# Altium project dtb-222.PrjPcb
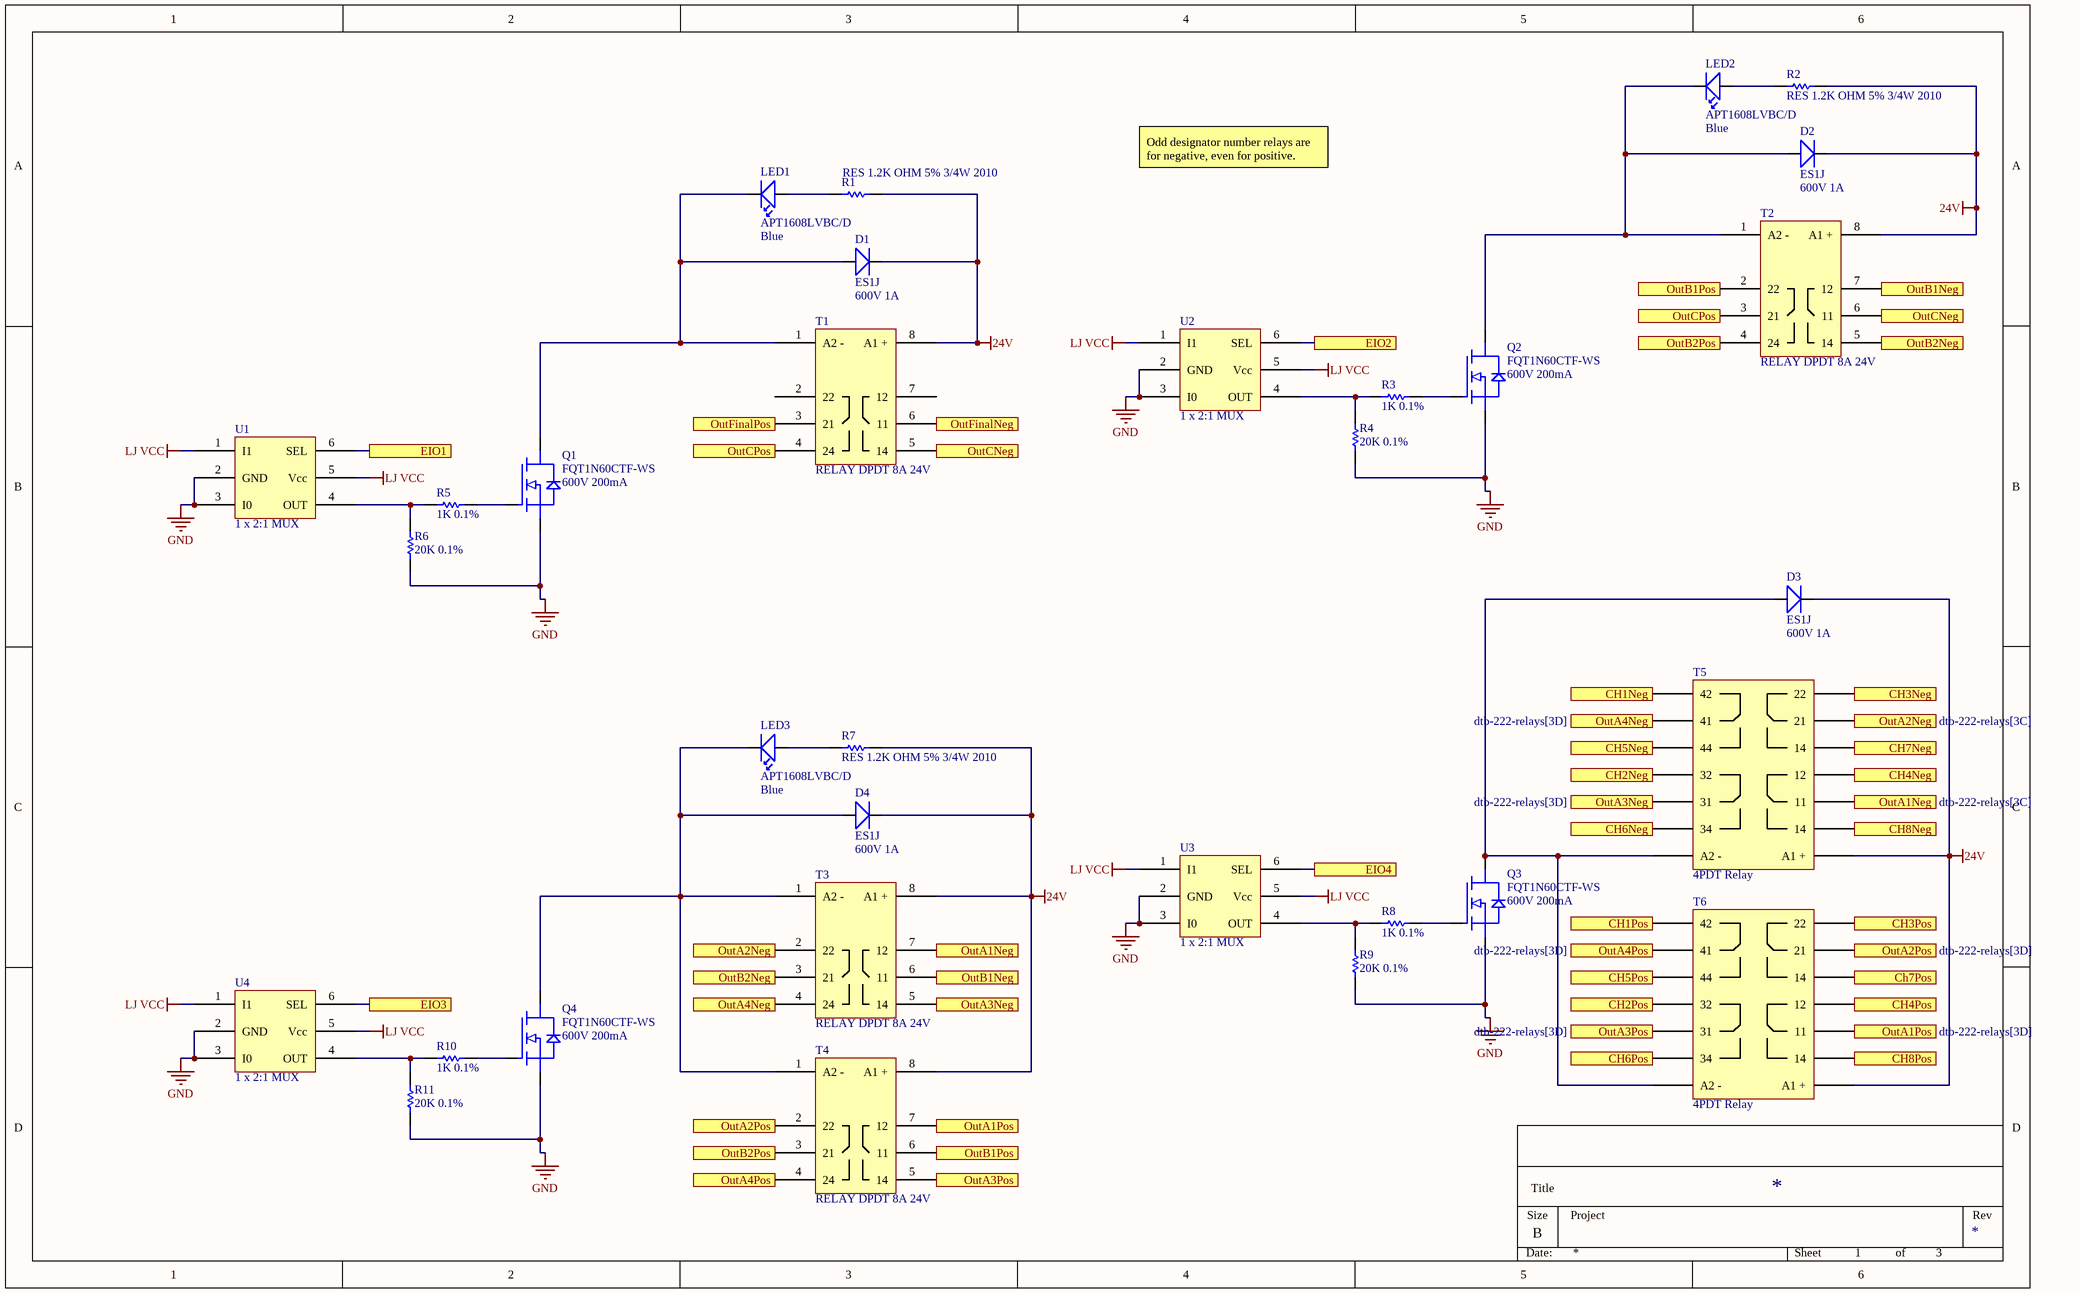
[diagram p0: dtb-222-relays.SchDoc]
3 sheets, 54 parts. Net scope: flat (ports and power ports of the same name join across sheets).
Board file: dtb-222-AW1.PcbDoc
Sheets:
  dtb-222-relays.SchDoc
  dtb-222-connectors.SchDoc
  dtb-222-24V-supply.SchDoc

## Sheet dtb-222-relays.SchDoc
size 381 x 241 mm; SheetNumber: 1; SheetTotal: 3

### Parts
(Parts that share a designator on the sheet are numbered #1, #2 ... from top to bottom, then left to right.)
?#1  (no value)  (graphical)
D1  ES1J  value 600V 1A  [ES1J]
D2  ES1J  value 600V 1A  [ES1J]
D3  ES1J  value 600V 1A  [ES1J]
D4  ES1J  value 600V 1A  [ES1J]
LED1  APT1608LVBC/D  value Blue  [Standard VoltServer 0603 Kingbright HELI2 LED Footprint]
LED2  APT1608LVBC/D  value Blue  [Standard VoltServer 0603 Kingbright HELI2 LED Footprint]
LED3  APT1608LVBC/D  value Blue  [Standard VoltServer 0603 Kingbright HELI2 LED Footprint]
Q1  FQT1N60CTF-WS  value 600V 200mA  [FQT1N60CTF_WS]
Q2  FQT1N60CTF-WS  value 600V 200mA  [FQT1N60CTF_WS]
Q3  FQT1N60CTF-WS  value 600V 200mA  [FQT1N60CTF_WS]
Q4  FQT1N60CTF-WS  value 600V 200mA  [FQT1N60CTF_WS]
R1  RES 1.2K OHM 5% 3/4W 2010  [2010 Resistor]
R2  RES 1.2K OHM 5% 3/4W 2010  [2010 Resistor]
R3  value 1K 0.1%  [Standard VoltServer 0603 Resistor Footprint]  (hidden comment: ERA-3AEB102V)
R4  value 20K 0.1%  [Standard VoltServer 0603 Resistor Footprint]  (hidden comment: ERA-3AEB203V)
R5  value 1K 0.1%  [Standard VoltServer 0603 Resistor Footprint]  (hidden comment: ERA-3AEB102V)
R6  value 20K 0.1%  [Standard VoltServer 0603 Resistor Footprint]  (hidden comment: ERA-3AEB203V)
R7  RES 1.2K OHM 5% 3/4W 2010  [2010 Resistor]
R8  value 1K 0.1%  [Standard VoltServer 0603 Resistor Footprint]  (hidden comment: ERA-3AEB102V)
R9  value 20K 0.1%  [Standard VoltServer 0603 Resistor Footprint]  (hidden comment: ERA-3AEB203V)
R10  value 1K 0.1%  [Standard VoltServer 0603 Resistor Footprint]  (hidden comment: ERA-3AEB102V)
R11  value 20K 0.1%  [Standard VoltServer 0603 Resistor Footprint]  (hidden comment: ERA-3AEB203V)
T1  RELAY DPDT 8A 24V  [2961435]
T2  RELAY DPDT 8A 24V  [2961435]
T3  RELAY DPDT 8A 24V  [2961435]
T4  RELAY DPDT 8A 24V  [2961435]
T5  4PDT Relay  [2903677]
T6  4PDT Relay  [2903677]
U1  1 x 2:1 MUX  [74LVC1G157GV,125]
U2  1 x 2:1 MUX  [74LVC1G157GV,125]
U3  1 x 2:1 MUX  [74LVC1G157GV,125]
U4  1 x 2:1 MUX  [74LVC1G157GV,125]

### Ports
CH1Neg (see dtb-222-connectors[3A]), CH1Pos (see dtb-222-connectors[3A]), CH2Neg (see dtb-222-connectors[3A]), CH2Pos (see dtb-222-connectors[3A]), CH3Neg (see dtb-222-connectors[3A]), CH3Pos (see dtb-222-connectors[3A]), CH4Neg (see dtb-222-connectors[3A]), CH4Pos (see dtb-222-connectors[3A]), CH5Neg (see dtb-222-connectors[3A]), CH5Pos (see dtb-222-connectors[3A]), CH6Neg (see dtb-222-connectors[3B]), CH6Pos (see dtb-222-connectors[3A]), CH7Neg (see dtb-222-connectors[3A]), Ch7Pos (see dtb-222-connectors[3B]), CH8Neg (see dtb-222-connectors[3A]), CH8Pos (see dtb-222-connectors[3A]), EIO1 (see dtb-222-connectors[2A]), EIO2 (see dtb-222-connectors[1A]), EIO3 (see dtb-222-connectors[2A]), EIO4 (see dtb-222-connectors[1A]), OutA1Neg (see dtb-222-relays[3C]), OutA1Neg (see dtb-222-relays[6C]), OutA1Pos (see dtb-222-relays[3D]), OutA1Pos (see dtb-222-relays[6D]), OutA2Neg (see dtb-222-relays[3C]), OutA2Neg (see dtb-222-relays[6C]), OutA2Pos (see dtb-222-relays[3D]), OutA2Pos (see dtb-222-relays[6C]), OutA3Neg (see dtb-222-relays[3D]), OutA3Neg (see dtb-222-relays[5C]), OutA3Pos (see dtb-222-relays[3D]), OutA3Pos (see dtb-222-relays[5D]), OutA4Neg (see dtb-222-relays[3D]), OutA4Neg (see dtb-222-relays[5C]), OutA4Pos (see dtb-222-relays[3D]), OutA4Pos (see dtb-222-relays[5C]), OutB1Neg (see dtb-222-relays[3D]), OutB1Neg (see dtb-222-relays[6A]), OutB1Pos (see dtb-222-relays[3D]), OutB1Pos (see dtb-222-relays[5A]), OutB2Neg (see dtb-222-relays[3D]), OutB2Neg (see dtb-222-relays[6B]), OutB2Pos (see dtb-222-relays[3D]), OutB2Pos (see dtb-222-relays[5B]), OutCNeg (see dtb-222-relays[3B]), OutCNeg (see dtb-222-relays[6A]), OutCPos (see dtb-222-relays[3B]), OutCPos (see dtb-222-relays[5A]), OutFinalNeg (see dtb-222-connectors[3B]), OutFinalPos (see dtb-222-connectors[3B])

### Nets
24V: D1.1 D2.1 D3.1 D4.1 R1.2 R2.2 R7.2 T1.8(A1_+) T2.8(A1_+) T3.8(A1_+) T4.8(A1_+) T5.1(A1_+) T6.1(A1_+)
GND: Q1.3(S) Q2.3(S) Q3.3(S) Q4.3(S) R4.1 R6.1 R9.1 R11.1 U1.2(GND) U1.3(I0) U2.2(GND) U2.3(I0) U3.2(GND) U3.3(I0) U4.2(GND) U4.3(I0)
LJ VCC: U1.1(I1) U1.5(Vcc) U2.1(I1) U2.5(Vcc) U3.1(I1) U3.5(Vcc) U4.1(I1) U4.5(Vcc)
NetD1_2: D1.2 LED1.2 Q1.4(D) T1.1(A2_-)
NetD2_2: D2.2 LED2.2 Q2.4(D) T2.1(A2_-)
NetD3_2: D3.2 Q3.4(D) T5.2(A2_-) T6.2(A2_-)
NetD4_2: D4.2 LED3.2 Q4.4(D) T3.1(A2_-) T4.1(A2_-)
NetJ1_5: U2.6(SEL) ; port EIO2
NetJ1_6: U3.6(SEL) ; port EIO4
NetJ1_12: U1.6(SEL) ; port EIO1
NetJ1_13: U4.6(SEL) ; port EIO3
NetJ3_1: T5.11(12) ; port CH4Neg
NetJ3_2: T6.11(12) ; port CH4Pos
NetJ3_3: T5.12(22) ; port CH3Neg
NetJ3_4: T6.12(22) ; port CH3Pos
NetJ3_5: T5.13(32) ; port CH2Neg
NetJ3_6: T6.13(32) ; port CH2Pos
NetJ3_7: T5.14(42) ; port CH1Neg
NetJ3_8: T6.14(42) ; port CH1Pos
NetJ4_1: T5.7(14) ; port CH8Neg
NetJ4_2: T6.7(14) ; port CH8Pos
NetJ4_3: T5.8(14) ; port CH7Neg
NetJ4_4: T6.8(14) ; port Ch7Pos
NetJ4_5: T5.9(34) ; port CH6Neg
NetJ4_6: T6.9(34) ; port CH6Pos
NetJ4_7: T5.10(44) ; port CH5Neg
NetJ4_8: T6.10(44) ; port CH5Pos
NetJ5_1: T1.3(21) ; port OutFinalPos
NetJ5_2: T1.6(11) ; port OutFinalNeg
NetLED1_1: LED1.1 R1.1
NetLED2_1: LED2.1 R2.1
NetLED3_1: LED3.1 R7.1
NetQ1_1: Q1.1(G) R5.1
NetQ2_1: Q2.1(G) R3.1
NetQ3_1: Q3.1(G) R8.1
NetQ4_1: Q4.1(G) R10.1
NetR3_2: R3.2 R4.2 U2.4(OUT)
NetR5_2: R5.2 R6.2 U1.4(OUT)
NetR8_2: R8.2 R9.2 U3.4(OUT)
NetR10_2: R10.2 R11.2 U4.4(OUT)
NetT1_4: T1.4(24) T2.3(21) ; port OutCPos
NetT1_5: T1.5(14) T2.6(11) ; port OutCNeg
NetT2_2: T2.2(22) T4.6(11) ; port OutB1Pos
NetT2_4: T2.4(24) T4.3(21) ; port OutB2Pos
NetT2_5: T2.5(14) T3.3(21) ; port OutB2Neg
NetT2_7: T2.7(12) T3.6(11) ; port OutB1Neg
NetT3_2: T3.2(22) T5.4(21) ; port OutA2Neg
NetT3_4: T3.4(24) T5.6(41) ; port OutA4Neg
NetT3_5: T3.5(14) T5.5(31) ; port OutA3Neg
NetT3_7: T3.7(12) T5.3(11) ; port OutA1Neg
NetT4_2: T4.2(22) T6.4(21) ; port OutA2Pos
NetT4_4: T4.4(24) T6.6(41) ; port OutA4Pos
NetT4_5: T4.5(14) T6.5(31) ; port OutA3Pos
NetT4_7: T4.7(12) T6.3(11) ; port OutA1Pos

Not connected (* = marked no-connect by the designer): T1 2(22) 7(12)

### Notes on the sheet
- Odd designator number relays are for negative, even for positive.
- Size
- Title
- B
- Project
- Rev
- Date:
- Sheet
- of

### Library data of the parts
?#1 = VoltServer Title Block
D1-D4 = ES1J: DIODE 1A 600V 35nS SMA; Manufacturer: Fairchild; Vendor PN: ES1JFSCT-ND; Vendor: Digikey; Manufacturer PN: ES1J
LED1-LED3 = APT1608LVBC/D: Blue 470nm LED Indication - Discrete 2.65V 0603 (1608 Metric); Manufacturer: Kingbright; Vendor: Digikey; Vendor PN: 754-1933-1-ND; Manufacturer PN: APT1608LVBC/D
Q1-Q4 = FQT1N60CTF-WS: MOSFET N-CH 600V 200MA SOT-223-4; Manufacturer: Fairchild Semiconductor; Vendor: Digikey; Vendor PN: FQT1N60CTF-WSCT-ND; Manufacturer PN: FQT1N60CTF-WS
R1 R2 R7 = RMCF2010JT1K20: 1.2 kOhms ±5% 0.75W, 3/4W Chip Resistor 2010 (5025 Metric) Automotive AEC-Q200 Thick Film; Manufacturer: Stackpole Electionics Inc; Value: 1.2 kOhm, +/- 5%, 0.75W; Vendor: Digi-Key; Vendor PN: RMCF2010JT1K20CT-ND; Manufacturer PN: RMCF2010JT1K20
R3 R5 R8 R10 = ERA-3AEB102V: RES SMD 1K OHM 0.1% 1/10W 0603; Manufacturer: Panasonic; Vendor: Digikey; Vendor PN: P1.0KDBCT-ND; Manufacturer PN: ERA-3AEB102V
R4 R6 R9 R11 = ERA-3AEB203V: RES SMD 20K OHM 0.1% 1/10W 0603; Manufacturer: Panasonic; Vendor: Digikey; Vendor PN: P20KDBCT-ND; Manufacturer PN: ERA-3AEB203V
T1-T4 = 2961435 with R95-132: Relay 2961435 with R95-132 socket for pcb mounting; Manufacturer: Phoenix Contact; NTE Electronics Inc; Manufacturer PN: 2961435; R95-132; Vendor: Digi-Key; Vendor PN: 277-5185-ND; 2368-R95-132-ND; Value: DPDT Relay
T5 T6 = 2903677 with PY14-02: General Purpose Relay 4PDT (4 Form C) 24VDC Coil Socketable with Socket; Manufacturer: Phoenix Contact; Omron Automation and Safety; Manufacturer PN: 2903677; PY14-02; Vendor: Digi-Key; Vendor PN: 277-11902-ND; Z813-ND; Value: 4PDT Relay with Socket
U1-U4 = 74LVC1G157GV,125: Multiplexer 1 x 2:1 6-TSOP; Manufacturer: Nexperia USA Inc.; Vendor: Digi-Key; Vendor PN: 1727-3490-1-ND; Value: 1 x 2:1 MUX; Manufacturer PN: 74LVC1G157GV,125

## Sheet dtb-222-connectors.SchDoc
size 381 x 241 mm; SheetNumber: 2; SheetTotal: 3
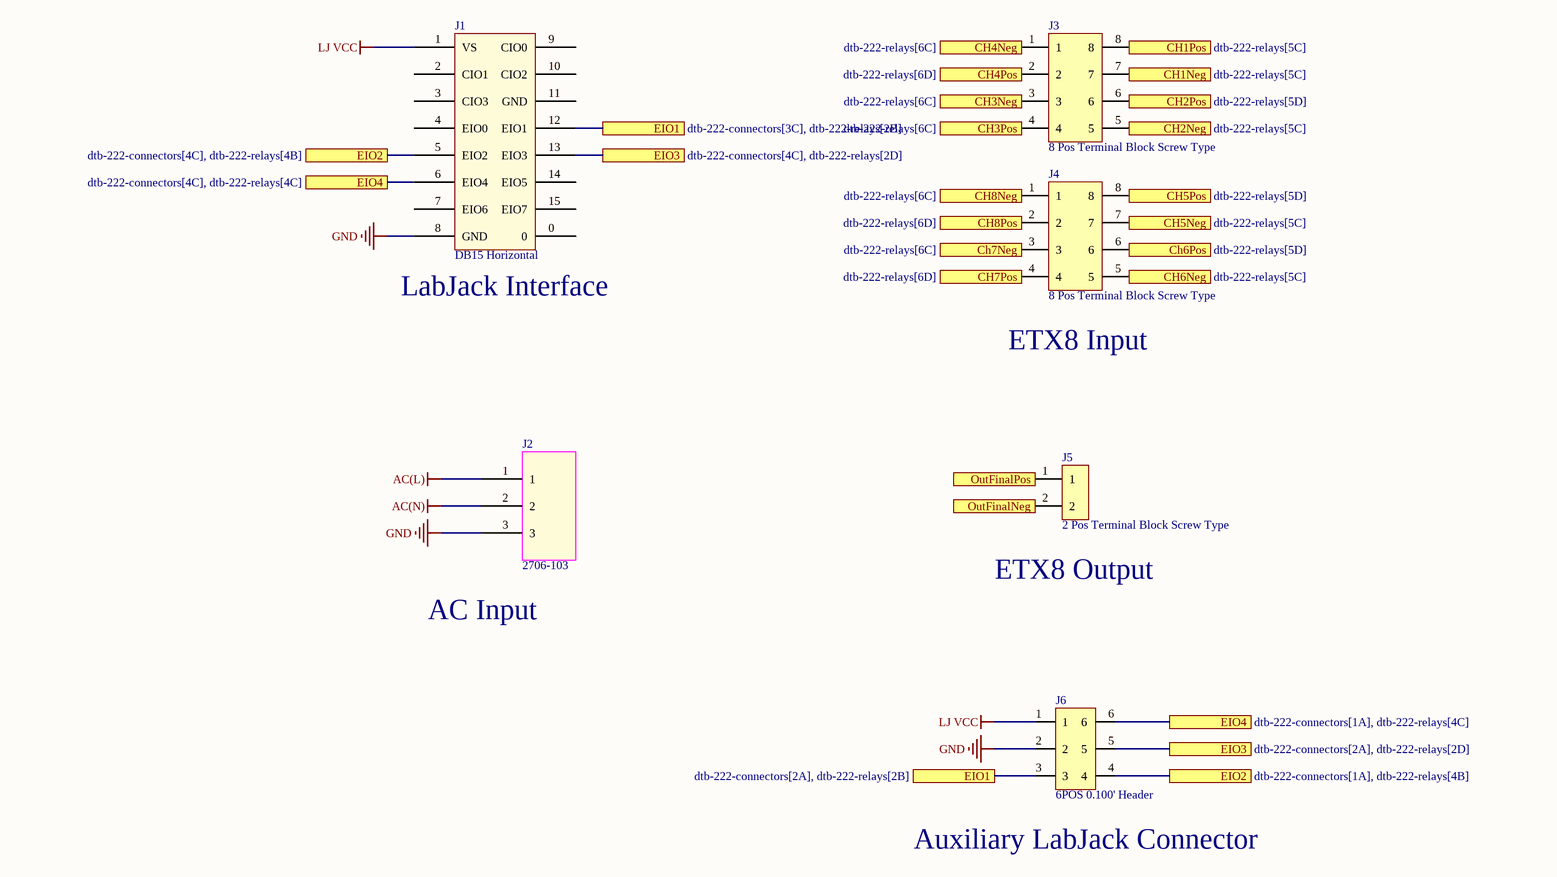
[diagram p1: dtb-222-connectors.SchDoc]

### Parts
(Parts that share a designator on the sheet are numbered #1, #2 ... from top to bottom, then left to right.)
?#2  (no value)  (graphical)
J1  DB15 Horizontal  [182-015-113R531]
J2  2706-103  [2706-103]
J3  8 Pos Terminal Block Screw Type  [TB008A-508-08BE]
J4  8 Pos Terminal Block Screw Type  [TB008A-508-08BE]
J5  2 Pos Terminal Block Screw Type  [TB008A-508-02BE]
J6  6POS 0.100' Header  [67997-206HLF]

### Ports
CH1Neg (see dtb-222-relays[5C]), CH1Pos (see dtb-222-relays[5C]), CH2Neg (see dtb-222-relays[5C]), CH2Pos (see dtb-222-relays[5D]), CH3Neg (see dtb-222-relays[6C]), CH3Pos (see dtb-222-relays[6C]), CH4Neg (see dtb-222-relays[6C]), CH4Pos (see dtb-222-relays[6D]), CH5Neg (see dtb-222-relays[5C]), CH5Pos (see dtb-222-relays[5D]), CH6Neg (see dtb-222-relays[5C]), Ch6Pos (see dtb-222-relays[5D]), Ch7Neg (see dtb-222-relays[6C]), CH7Pos (see dtb-222-relays[6D]), CH8Neg (see dtb-222-relays[6C]), CH8Pos (see dtb-222-relays[6D]), EIO1 (see dtb-222-connectors[2A], dtb-222-relays[2B]), EIO1 (see dtb-222-connectors[3C], dtb-222-relays[2B]), EIO2 (see dtb-222-connectors[1A], dtb-222-relays[4B]), EIO2 (see dtb-222-connectors[4C], dtb-222-relays[4B]), EIO3 (see dtb-222-connectors[2A], dtb-222-relays[2D]), EIO3 (see dtb-222-connectors[4C], dtb-222-relays[2D]), EIO4 (see dtb-222-connectors[1A], dtb-222-relays[4C]), EIO4 (see dtb-222-connectors[4C], dtb-222-relays[4C]), OutFinalNeg (see dtb-222-relays[3B]), OutFinalPos (see dtb-222-relays[3B])

### Nets
AC(L): J2.1
AC(N): J2.2
GND: J1.8(GND) J2.3 J6.2
LJ VCC: J1.1(VS) J6.1
NetJ1_5: J1.5(EIO2) J6.4 ; port EIO2
NetJ1_6: J1.6(EIO4) J6.6 ; port EIO4
NetJ1_12: J1.12(EIO1) J6.3 ; port EIO1
NetJ1_13: J1.13(EIO3) J6.5 ; port EIO3
NetJ3_1: J3.1 ; port CH4Neg
NetJ3_2: J3.2 ; port CH4Pos
NetJ3_3: J3.3 ; port CH3Neg
NetJ3_4: J3.4 ; port CH3Pos
NetJ3_5: J3.5 ; port CH2Neg
NetJ3_6: J3.6 ; port CH2Pos
NetJ3_7: J3.7 ; port CH1Neg
NetJ3_8: J3.8 ; port CH1Pos
NetJ4_1: J4.1 ; port CH8Neg
NetJ4_2: J4.2 ; port CH8Pos
NetJ4_3: J4.3 ; port Ch7Neg
NetJ4_4: J4.4 ; port CH7Pos
NetJ4_5: J4.5 ; port CH6Neg
NetJ4_6: J4.6 ; port Ch6Pos
NetJ4_7: J4.7 ; port CH5Neg
NetJ4_8: J4.8 ; port CH5Pos
NetJ5_1: J5.1 ; port OutFinalPos
NetJ5_2: J5.2 ; port OutFinalNeg

Not connected (* = marked no-connect by the designer): J1 0 2(CIO1) 3(CIO3) 4(EIO0) 7(EIO6) 9(CIO0) 10(CIO2) 11(GND) 14(EIO5) 15(EIO7)

### Notes on the sheet
- (near J1) LabJack Interface
- (near J4) ETX8 Input
- AC Input
- (near J5) ETX8 Output
- (near J6) Auxiliary LabJack Connector
- Size
- Title
- B
- Project
- Rev
- Date:
- Sheet
- of

### Library data of the parts
?#2 = VoltServer Title Block
J1 = DB15 LabJack Pinout: 15 Position D-Sub Plug, Male Pins Connector; Manufacturer: NorComp Inc.; Vendor: Digikey; Vendor PN: 182-15ME-ND; Value: DB 16 Male; Manufacturer PN: 182-015-113R531
J2 = 2706-103: 3 Position Wire to Board Terminal Block Horizontal with Board 0.295" (7.50mm) Through Hole; Manufacturer: WAGO Corporation; Value: 3-Pos Terminal Block Horizontal; Vendor: Digi-Key; Vendor PN: 2946-2706-103-ND; Manufacturer PN: 2706-103
J3 J4 = TB008A-508-08BE: 8 Position Wire to Board Terminal Block 45° (135°) Angle with Board 0.200" (5.08mm) Through Hole; Manufacturer: CUI Devices; Manufacturer PN: TB008A-508-08DE; Vendor: Digi-Key; Vendor PN: 102-6216-ND; Value: 8 pos screw terminal
J5 = TB008A-508-02BE: 2 Position Wire to Board Terminal Block 45° (135°) Angle with Board 0.200" (5.08mm) Through Hole; Manufacturer: CUI Devices; Manufacturer PN: TB008A-508-02DE; Vendor: Digi-Key; Vendor PN: 102-6213-ND; Value: 2 pos screw terminal
J6 = 67997-206HLF: Connector Header Through Hole 6 position 0.100" (2.54mm); Manufacturer: Amphenol ICC (FCI); Vendor: Digi-Key; Vendor PN: 609-3234-ND; Value: CONN HEADER VERT 6POS 2.54MM; Manufacturer PN: 67997-206HLF

## Sheet dtb-222-24V-supply.SchDoc
size 381 x 241 mm; SheetNumber: 3; SheetTotal: 3
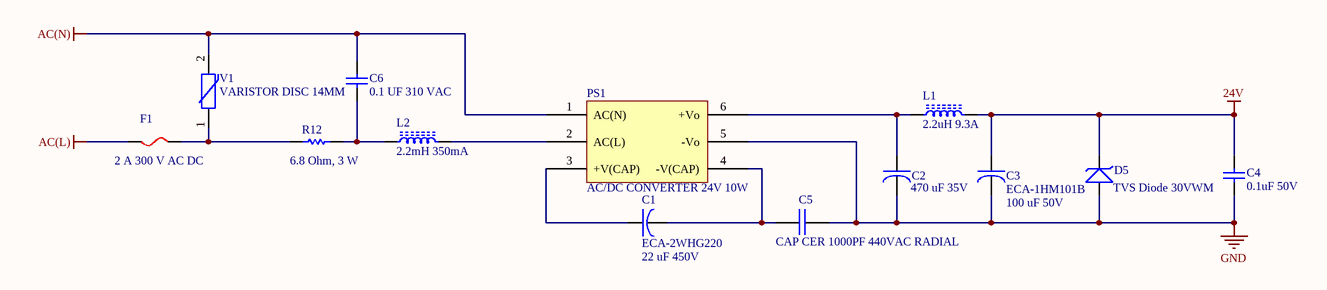
[diagram p2: dtb-222-24V-supply.SchDoc]

### Parts
(Parts that share a designator on the sheet are numbered #1, #2 ... from top to bottom, then left to right.)
?#3  (no value)  (graphical)
C1  ECA-2WHG220  value 22 uF 450V  [ECA-2WHG220]
C2  value 470 uF 35V  [35PX470MEFC10X12.5]  (hidden comment: 35PX470MEFC10X12.5)
C3  ECA-1HM101B  value 100 uF 50V  [ECA-1HM101B]
C4  value 0.1uF 50V  [Standard VoltServer 0603 Capacitor Footprint]  (hidden comment: CGA3E2X7R1H104K080AE)
C5  CAP CER 1000PF 440VAC RADIAL  [CD45-E2GA102M-VKA]
C6  value 0.1 UF 310 VAC  [890334023023CS]  (hidden comment: CAP FILM 0.1UF 10%)
D5  value TVS Diode 30VWM  [SMBJ30A]  (hidden comment: TVS DIODE 30VWM 48.4VC SMB)
F1  2 A 300 V AC DC  [SS-5H-2A-APH]
L1  value 2.2uH 9.3A  [0630CDMCCDS-2R2MC]  (hidden comment: FIXED IND 2.2UH 9.3A 15MOHM SMD)
L2  value 2.2mH 350mA  [RLB1112V4-222J]  (hidden comment: FIXED IND 2.2MH 350MA 3.2 OHM TH)
PS1  AC/DC CONVERTER 24V 10W  [LS10-13B24R3]
R12  value 6.8 Ohm, 3 W  [AC03000006808JAC00]  (hidden comment: RES 6.8 OHM 3W 5% AXIAL)
V1  VARISTOR DISC 14MM  [B72214S0351K101]

### Nets
24V: C3.1 C4.2 D5.1(Cathode) L1.2
AC(L): F1.1
AC(N): C6.2 PS1.1(AC(N)) V1.2
GND: C2.2 C3.2 C4.1 C5.2 D5.2(Anode) PS1.5(-Vo)
NetC1_1: C1.1 PS1.3(+V(CAP))
NetC1_2: C1.2 C5.1 PS1.4(-V(CAP))
NetC2_1: C2.1 L1.1 PS1.6(+Vo)
NetC6_1: C6.1 L2.1 R12.2
NetF1_2: F1.2 R12.1 V1.1
NetL2_2: L2.2 PS1.2(AC(L))

### Notes on the sheet
- Size
- Title
- B
- Project
- Rev
- Date:
- Sheet
- of

### Library data of the parts
?#3 = VoltServer Title Block
C1 = ECA-2WHG220: 22 µF 450 V Aluminum Electrolytic Capacitors Radial, Can 2000 Hrs @ 105°C; Manufacturer: Panasonic Electronic Components; Vendor: Digikey; Vendor PN: P5877-ND; Manufacturer PN: ECA-2WHG220
C2 = 35PX470MEFC10X12.5: 470 µF 35 V Aluminum Electrolytic Capacitors Radial, Can 2000 Hrs @ 105°C; Manufacturer: Rubycon; Vendor: Digikey; Vendor PN: 1189-1280-ND; Manufacturer PN: 35PX470MEFC10X12.5
C3 = ECA-1HM101B: 100 µF 20% 50 V Aluminum Electrolytic Capacitors Radial, Can 2000 Hrs @ 85°C; Manufacturer: Panasonic Electronic Components; Vendor: Digikey; Vendor PN: P10397TB-ND; Manufacturer PN: ECA-1HM101B
C4 = CGA3E2X7R1H104K080AE: CAP CER 0.1UF 50V 10% X7R 0603; Manufacturer: TDK; Vendor: Digikey; Vendor PN: 445-15957-1-ND; Manufacturer PN: CGA3E2X7R1H104K080AE
C5 = CD45-E2GA102M-VKA: 1000 pF ±20% 440VAC Ceramic Capacitor E Radial, Disc; Manufacturer: TDK Corporation; Vendor: Digi-Key; Vendor PN: 445-175355-1-ND; Value: CAP CER 1000PF 440VAC RADIAL; Manufacturer PN: CD45-E2GA102M-VKA
C6 = 890334023023CS: 0.1 µF Film Capacitor 310V Polypropylene (PP), Metallized Radial; Manufacturer: Wurth Elektronik; Vendor: Digikey; Vendor PN: 732-5733-ND; Manufacturer PN: 890334023023CS
D5 = SMBJ30A: 48.4V Clamp 12.4A Ipp Tvs Diode Surface Mount SMB (DO-214AA); Manufacturer: Bourns Inc.; Vendor PN: SMBJ30ABTR-ND; Vendor: Digikey; Manufacturer PN: SMBJ30A
F1 = SS-5H-2A-APH: 2 A 300 V AC DC Fuse Board Mount (Cartridge Style Excluded) Through Hole Radial, Box; Manufacturer: Eaton; Vendor: Digi-Key; Vendor PN: 283-4166-1-ND; Value: FUSE BOARD MNT 2A 300VAC RADIAL; Manufacturer PN: SS-5H-2A-APH
L1 = 0630CDMCCDS-2R2MC: 2.2 µH Shielded Molded Inductor 9.3 A 15mOhm Max Nonstandard; Manufacturer: Sumida America Components Inc.; Vendor: Digikey; Vendor PN: 308-2464-6-ND; Manufacturer PN: 0630CDMCCDS-2R2MC
L2 = RLB1112V4-222J: 2.2 mH Unshielded Drum Core, Wirewound Inductor 350 mA 3.2Ohm Max Radial, Vertical Cylinder; Manufacturer: Bourns Inc.; Vendor: Digikey; Vendor PN: 118-RLB1112V4-222JTR-ND; Manufacturer PN: RLB1112V4-222J
PS1 = LS10-13B24R3: Open Frame AC DC Converters 1 Output 24V 420mA 85 ~ 305 VAC, 100 ~ 430 VDC Input; Manufacturer: Mornsun America, LLC; Vendor: Digi-Key; Vendor PN: 2725-LS10-13B24R3-ND; Value: AC/DC CONVERTER 24V 10W; Manufacturer PN: LS10-13B24R3
R12 = AC03000006808JAC00: 6.8 Ohms ±5% 3W Through Hole Resistor Axial Flame Retardant Coating, Pulse Withstanding, Safety Wirewound; Manufacturer: Vishay Beyschlag/Draloric/BB Components; Vendor: Digi-Key; Vendor PN: 749-AC03000006808JAC00CT-ND; Manufacturer PN: AC03000006808JAC00
V1 = B72214S0351K101: 560 V 4.5 kA Varistor 1 Circuit Through Hole Disc 14mm; Manufacturer: EPCOS - TDK Electronics; Vendor: Digi-Key; Vendor PN: 495-6464-ND; Value: 560 V 4.5 kA Varistor; Manufacturer PN: B72214S0351K101

## Nets that join several sheets
24V: dtb-222-relays (13 pins), dtb-222-24V-supply (C3.1 C4.2 D5.1 L1.2)
AC(L): dtb-222-connectors (J2.1), dtb-222-24V-supply (F1.1)
AC(N): dtb-222-connectors (J2.2), dtb-222-24V-supply (C6.2 PS1.1 V1.2)
GND: dtb-222-relays (16 pins), dtb-222-connectors (J1.8 J2.3 J6.2), dtb-222-24V-supply (6 pins)
LJ VCC: dtb-222-relays (8 pins), dtb-222-connectors (J1.1 J6.1)
NetJ1_5: dtb-222-relays (U2.6), dtb-222-connectors (J1.5 J6.4)
NetJ1_6: dtb-222-relays (U3.6), dtb-222-connectors (J1.6 J6.6)
NetJ1_12: dtb-222-relays (U1.6), dtb-222-connectors (J1.12 J6.3)
NetJ1_13: dtb-222-relays (U4.6), dtb-222-connectors (J1.13 J6.5)
NetJ3_1: dtb-222-relays (T5.11), dtb-222-connectors (J3.1)
NetJ3_2: dtb-222-relays (T6.11), dtb-222-connectors (J3.2)
NetJ3_3: dtb-222-relays (T5.12), dtb-222-connectors (J3.3)
NetJ3_4: dtb-222-relays (T6.12), dtb-222-connectors (J3.4)
NetJ3_5: dtb-222-relays (T5.13), dtb-222-connectors (J3.5)
NetJ3_6: dtb-222-relays (T6.13), dtb-222-connectors (J3.6)
NetJ3_7: dtb-222-relays (T5.14), dtb-222-connectors (J3.7)
NetJ3_8: dtb-222-relays (T6.14), dtb-222-connectors (J3.8)
NetJ4_1: dtb-222-relays (T5.7), dtb-222-connectors (J4.1)
NetJ4_2: dtb-222-relays (T6.7), dtb-222-connectors (J4.2)
NetJ4_3: dtb-222-relays (T5.8), dtb-222-connectors (J4.3)
NetJ4_4: dtb-222-relays (T6.8), dtb-222-connectors (J4.4)
NetJ4_5: dtb-222-relays (T5.9), dtb-222-connectors (J4.5)
NetJ4_6: dtb-222-relays (T6.9), dtb-222-connectors (J4.6)
NetJ4_7: dtb-222-relays (T5.10), dtb-222-connectors (J4.7)
NetJ4_8: dtb-222-relays (T6.10), dtb-222-connectors (J4.8)
NetJ5_1: dtb-222-relays (T1.3), dtb-222-connectors (J5.1)
NetJ5_2: dtb-222-relays (T1.6), dtb-222-connectors (J5.2)